# Altium schematic sheet ADC_PIC32_LVDS_DRIVER_Subsystem.SchDoc
size A; SheetNumber: 2; SheetTotal: 15
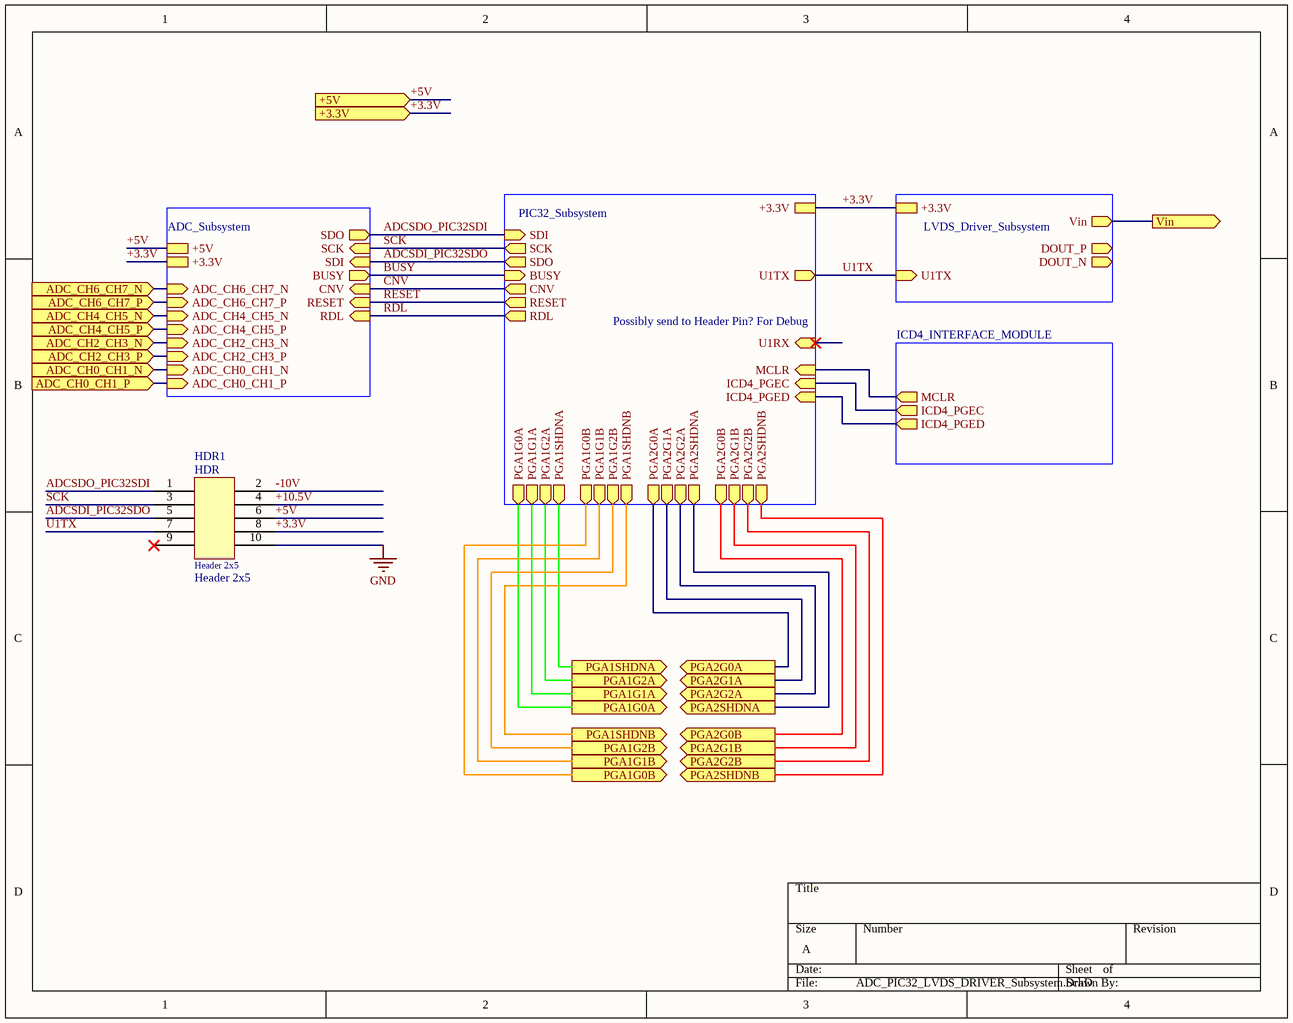
[diagram p0: ADC_PIC32_LVDS_DRIVER_Subsystem.SchDoc]

## Parts
HDR1  Header 2x5

## Sub-sheets
ADC_Subsystem = ADC_Subsystem.SchDoc: SDO (out), SCK (in), SDI (in), BUSY (out), CNV (in), RESET (in), RDL (in), +5V, +3.3V, ADC_CH6_CH7_N (in), ADC_CH6_CH7_P (in), ADC_CH4_CH5_N (in), ADC_CH4_CH5_P (in), ADC_CH2_CH3_N (in), ADC_CH2_CH3_P (in), ADC_CH0_CH1_P (in), ADC_CH0_CH1_N (in)
ICD4_INTERFACE_MODULE = ICD4_Interface_Module.SchDoc: MCLR (out), ICD4_PGEC (out), ICD4_PGED (out)
LVDS_Driver_Subsystem = LVDS_Driver_Subsystem.SchDoc: DOUT_P (out), DOUT_N (out), U1TX (in), +3.3V, Vin (out)
PIC32_Subsystem = PIC32_Subsystem.SchDoc: U1TX (out), U1RX (in), BUSY (in), RESET (out), CNV (out), SDO (out), SCK (out), SDI (in), RDL (out), ICD4_PGED (in), ICD4_PGEC (in), MCLR (in), PGA1G0A (out), PGA1G1A (out), PGA1G2A (out), PGA1SHDNA (out), PGA1G0B (out), PGA1G1B (out), PGA1G2B (out), PGA1SHDNB (out), PGA2G0A (out), PGA2G1A (out), PGA2G2A (out), PGA2SHDNA (out), PGA2G0B (out), PGA2G1B (out), PGA2G2B (out), PGA2SHDNB (out), +3.3V

## Ports
+3.3V (in), +5V (in), ADC_CH0_CH1_N (in), ADC_CH0_CH1_P (in), ADC_CH2_CH3_N (in), ADC_CH2_CH3_P (in), ADC_CH4_CH5_N (in), ADC_CH4_CH5_P (in), ADC_CH6_CH7_N (in), ADC_CH6_CH7_P (in), PGA1G0A (out), PGA1G0B (out), PGA1G1A (out), PGA1G1B (out), PGA1G2A (out), PGA1G2B (out), PGA1SHDNA (out), PGA1SHDNB (out), PGA2G0A (out), PGA2G0B (out), PGA2G1A (out), PGA2G1B (out), PGA2G2A (out), PGA2G2B (out), PGA2SHDNA (out), PGA2SHDNB (out), Vin (out)

## Nets
+3.3V: port +3.3V, sheet ADC_Subsystem/+3.3V, sheet PIC32_Subsystem/+3.3V, sheet LVDS_Driver_Subsystem/+3.3V
+5V: port +5V, sheet ADC_Subsystem/+5V
ADC_CH0_CH1_N: port ADC_CH0_CH1_N, sheet ADC_Subsystem/ADC_CH0_CH1_N
ADC_CH0_CH1_P: port ADC_CH0_CH1_P, sheet ADC_Subsystem/ADC_CH0_CH1_P
ADC_CH2_CH3_N: port ADC_CH2_CH3_N, sheet ADC_Subsystem/ADC_CH2_CH3_N
ADC_CH2_CH3_P: port ADC_CH2_CH3_P, sheet ADC_Subsystem/ADC_CH2_CH3_P
ADC_CH4_CH5_N: port ADC_CH4_CH5_N, sheet ADC_Subsystem/ADC_CH4_CH5_N
ADC_CH4_CH5_P: port ADC_CH4_CH5_P, sheet ADC_Subsystem/ADC_CH4_CH5_P
ADC_CH6_CH7_N: port ADC_CH6_CH7_N, sheet ADC_Subsystem/ADC_CH6_CH7_N
ADC_CH6_CH7_P: port ADC_CH6_CH7_P, sheet ADC_Subsystem/ADC_CH6_CH7_P
ADCSDI_PIC32SDO: sheet ADC_Subsystem/SDI, sheet PIC32_Subsystem/SDO
ADCSDO_PIC32SDI: sheet ADC_Subsystem/SDO, sheet PIC32_Subsystem/SDI
BUSY: sheet ADC_Subsystem/BUSY, sheet PIC32_Subsystem/BUSY
CNV: sheet ADC_Subsystem/CNV, sheet PIC32_Subsystem/CNV
PGA1G0A: port PGA1G0A, sheet PIC32_Subsystem/PGA1G0A
PGA1G0B: port PGA1G0B, sheet PIC32_Subsystem/PGA1G0B
PGA1G1A: port PGA1G1A, sheet PIC32_Subsystem/PGA1G1A
PGA1G1B: port PGA1G1B, sheet PIC32_Subsystem/PGA1G1B
PGA1G2A: port PGA1G2A, sheet PIC32_Subsystem/PGA1G2A
PGA1G2B: port PGA1G2B, sheet PIC32_Subsystem/PGA1G2B
PGA1SHDNA: port PGA1SHDNA, sheet PIC32_Subsystem/PGA1SHDNA
PGA1SHDNB: port PGA1SHDNB, sheet PIC32_Subsystem/PGA1SHDNB
PGA2G0A: port PGA2G0A, sheet PIC32_Subsystem/PGA2G0A
PGA2G0B: port PGA2G0B, sheet PIC32_Subsystem/PGA2G0B
PGA2G1A: port PGA2G1A, sheet PIC32_Subsystem/PGA2G1A
PGA2G1B: port PGA2G1B, sheet PIC32_Subsystem/PGA2G1B
PGA2G2A: port PGA2G2A, sheet PIC32_Subsystem/PGA2G2A
PGA2G2B: port PGA2G2B, sheet PIC32_Subsystem/PGA2G2B
PGA2SHDNA: port PGA2SHDNA, sheet PIC32_Subsystem/PGA2SHDNA
PGA2SHDNB: port PGA2SHDNB, sheet PIC32_Subsystem/PGA2SHDNB
RDL: sheet ADC_Subsystem/RDL, sheet PIC32_Subsystem/RDL
RESET: sheet ADC_Subsystem/RESET, sheet PIC32_Subsystem/RESET
SCK: sheet ADC_Subsystem/SCK, sheet PIC32_Subsystem/SCK
U1TX: sheet PIC32_Subsystem/U1TX, sheet LVDS_Driver_Subsystem/U1TX
Vin: port Vin, sheet LVDS_Driver_Subsystem/Vin
(unnamed): sheet PIC32_Subsystem/ICD4_PGED, sheet ICD4_INTERFACE_MODULE/ICD4_PGED
(unnamed): sheet PIC32_Subsystem/ICD4_PGEC, sheet ICD4_INTERFACE_MODULE/ICD4_PGEC
(unnamed): sheet PIC32_Subsystem/MCLR, sheet ICD4_INTERFACE_MODULE/MCLR

Not connected (* = marked no-connect by the designer): HDR1 1 2 3 4 5 6 7 8 9 10

## Notes on the sheet
- Possibly send to Header Pin? For Debug

## Library data of the parts
HDR1 = HDR